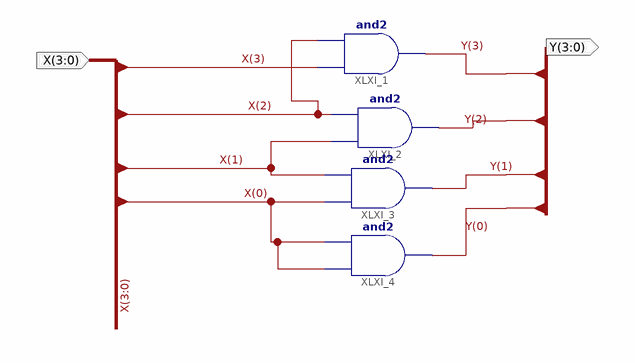
[diagram p0: schematic sheet 1]
// Xilinx ISE schematic pierwszy.sch (xc9500xl) as structural Verilog: 4 symbols, 2 ports
module pierwszy (
  input  [3:0] X,
  output [3:0] Y
);

  and XLXI_1 (Y[3], X[3], X[2]);
  and XLXI_2 (Y[2], X[1], X[2]);
  and XLXI_3 (Y[1], X[0], X[1]);
  and XLXI_4 (Y[0], X[0], X[0]);
endmodule
